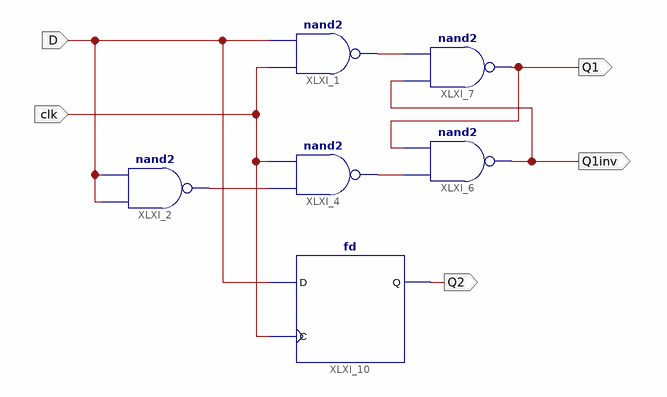
[diagram p0: schematic sheet 1]
// Xilinx ISE schematic D_schematic.sch (spartan3) as structural Verilog: 6 symbols, 5 ports
module D_schematic (
  input  clk,
  input  D,
  output Q1,
  output Q1inv,
  output Q2
);

  wire XLXN_3, XLXN_4, XLXN_13;

  nand XLXI_2 (XLXN_13, D, D);
  fd XLXI_10 (.C(clk), .D(D), .Q(Q2));
  nand XLXI_4 (XLXN_4, XLXN_13, clk);
  nand XLXI_6 (Q1inv, XLXN_4, Q1);
  nand XLXI_1 (XLXN_3, clk, D);
  nand XLXI_7 (Q1, Q1inv, XLXN_3);
endmodule
